# Altium schematic sheet soldeerboutmainbody1.SchDoc
size A4; SheetNumber: 1; SheetTotal: 3
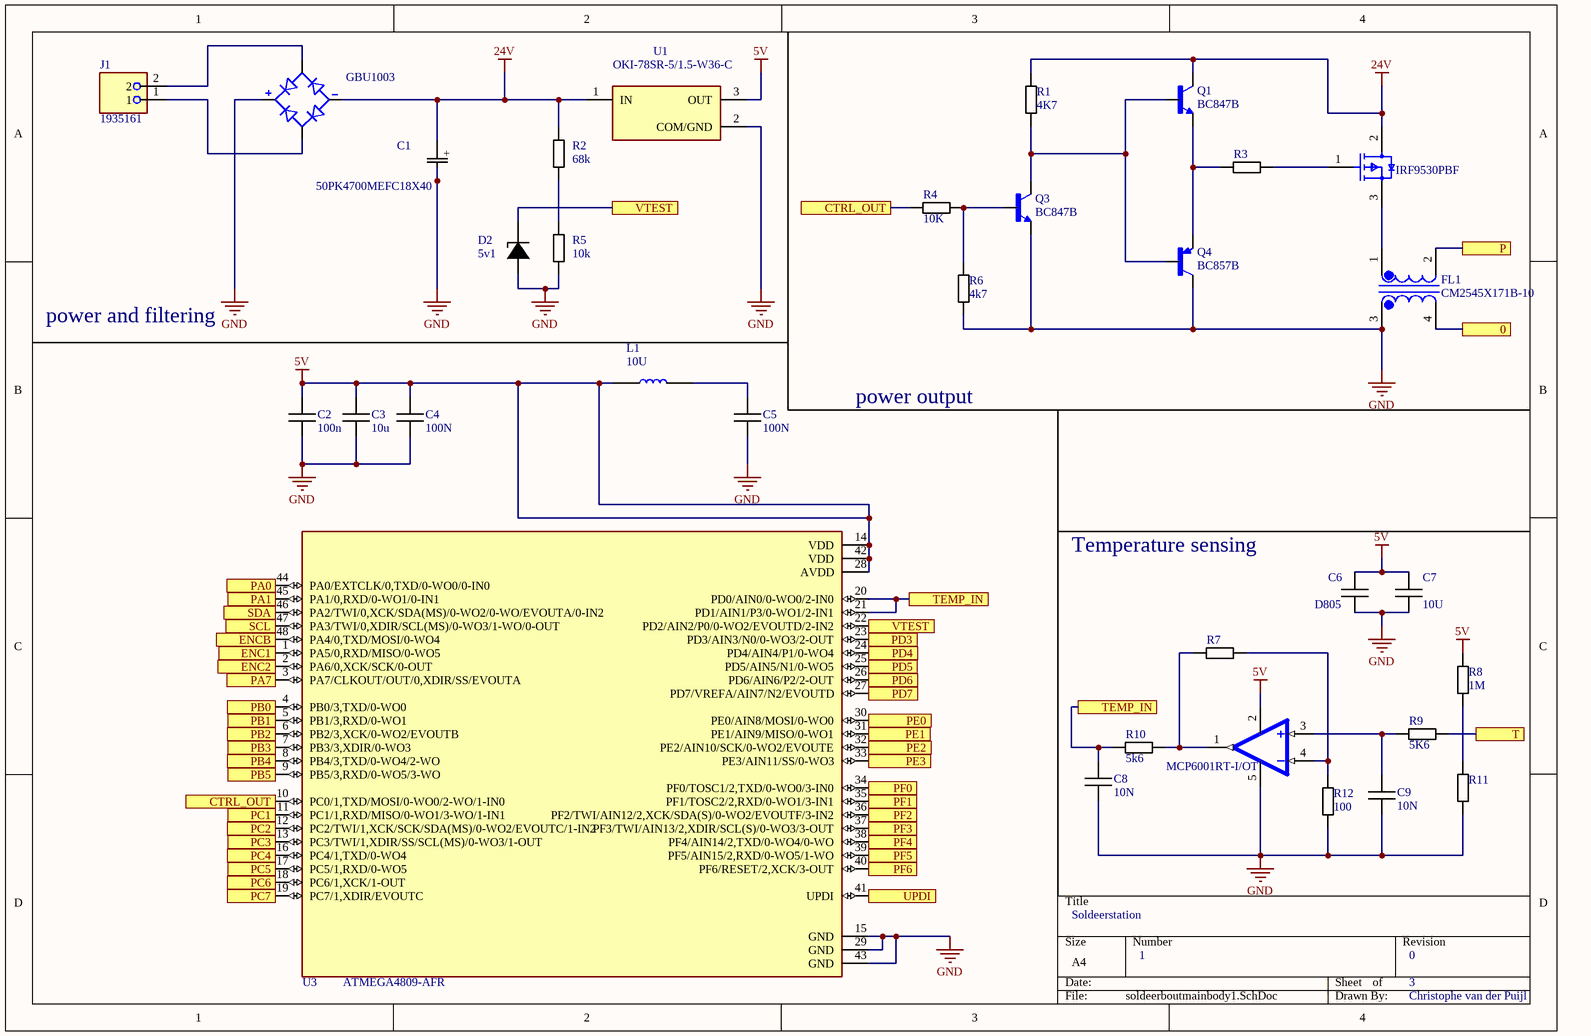
[diagram p0: soldeerboutmainbody1.SchDoc]

## Parts
C1  50PK4700MEFC18X40  [CAP_PKPZ_18X40_RUB]
C2  100n  [C 0603 / 1608]
C3  10u  [C 0603 / 1608]
C4  100N  [C 0603 / 1608]
C5  100N  [C 0603 / 1608]
C6  D805  [C 0603 / 1608]
C7  10U  [C 0603 / 1608]
C8  10N  [C 0603 / 1608]
C9  10N  [C 0603 / 1608]
D1  GBU1003  [SIP343W114P508L2205H2134Q4]
D2  5v1  [SOD3715X135N]
FL1  CM2545X171B-10  [XFMR_CM2545X171B-10]
J1  1935161  [PHOENIX_1935161]
L1  10U  [INDC2012X145N]
Q1  BC847B  [TRANS_BC847B]
Q2  IRF9530PBF  [FP-X15-0364-MFG]
Q3  BC847B  [TRANS_BC847B]
Q4  BC857B  [SOT95P240X120-3N]
R1  4K7  [R 0603]
R2  68k  [R 0603]
R3  100  [R 0603]  (value not drawn)
R4  10K  [R 0603]
R5  10k  [R 0603]
R6  4k7  [R 0603]
R7  18k  [R 0603]  (value not drawn)
R8  1M  [R 0603]
R9  5K6  [R 0603]
R10  5k6  [R 0603]
R11  10M  [R 0603]  (value not drawn)
R12  100  [R 0603]
U1  OKI-78SR-5/1.5-W36-C  [CONV_OKI-78SR-5/1.5-W36-C]
U2  MCP6001RT-I/OT  [SOT95P280X145-5N]
U3  ATMEGA4809-AFR  [QFP50P900X900X120-48N]

## Ports
0 (see soldeerboutmainbody2[4A]), CTRL_OUT (see soldeerboutmainbody1[1D]), CTRL_OUT (see soldeerboutmainbody1[3A]), ENC1 (see soldeerboutmainbody2[2A]), ENC2 (see soldeerboutmainbody2[2A]), ENCB (see soldeerboutmainbody2[2A]), P (see soldeerboutmainbody2[4A]), PA0 (see soldeerboutmainbody2[1D]), PA1 (see soldeerboutmainbody2[1D]), PA7 (see soldeerboutmainbody2[1D]), PB0 (see soldeerboutmainbody2[1D]), PB1 (see soldeerboutmainbody2[1D]), PB2 (see soldeerboutmainbody2[1D]), PB3 (see soldeerboutmainbody2[1D]), PB4 (see soldeerboutmainbody2[1D]), PB5 (see soldeerboutmainbody2[1D]), PC1 (see soldeerboutmainbody2[1D]), PC2 (see soldeerboutmainbody2[1D]), PC3 (see soldeerboutmainbody2[1D]), PC4 (see soldeerboutmainbody2[1D]), PC5 (see soldeerboutmainbody2[1D]), PC6 (see soldeerboutmainbody2[1D]), PC7 (see soldeerboutmainbody2[1D]), PD3 (see soldeerboutmainbody2[1C]), PD4 (see soldeerboutmainbody2[1C]), PD5 (see soldeerboutmainbody2[1C]), PD6 (see soldeerboutmainbody2[1C]), PD7 (see soldeerboutmainbody2[1C]), PE0 (see soldeerboutmainbody2[1C]), PE1 (see soldeerboutmainbody2[1C]), PE2 (see soldeerboutmainbody2[1C]), PE3 (see soldeerboutmainbody2[1C]), PF0 (see soldeerboutmainbody2[1C]), PF1 (see soldeerboutmainbody2[1C]), PF2 (see soldeerboutmainbody2[1D]), PF3 (see soldeerboutmainbody2[1D]), PF4 (see soldeerboutmainbody2[3A]), PF5 (see soldeerboutmainbody2[3B]), PF6 (see soldeerboutmainbody2[3A]), SCL (see soldeerboutmainbody2[1A], soldeerboutmainbody2[2A]), SDA (see soldeerboutmainbody2[1A], soldeerboutmainbody2[2A]), T (see soldeerboutmainbody2[4A]), TEMP_IN (see soldeerboutmainbody1[3C]), UPDI (see soldeerboutmainbody2[3B]), VTEST (see soldeerboutmainbody1[2A]), VTEST (see soldeerboutmainbody1[3C])

## Nets
5V: C2.1 C3.1 C4.1 C6.1 C7.1 L1.1 R8.2 U1.3(OUT) U2.2(VSS) U3.14(VDD) U3.28(AVDD) U3.42(VDD)
24V: C1.1 D1.NEG Q1.3(C) Q2.2(D) R1.2 R2.2 U1.1(IN)
GND: C1.2 C2.2 C3.2 C4.2 C5.2 C6.2 C7.2 C8.2 C9.2 D1.POS D2.A FL1.3 Q3.2(E) Q4.3(C) R5.1 R6.1 R11.1 R12.1 U1.2(COM/GND) U2.5(VDD) U3.15(GND) U3.29(GND) U3.43(GND)
0: FL1.4 ; port 0
CTRL_OUT: R4.1 U3.10(PC0/1,TXD/MOSI/0-WO0/2-WO/1-IN0) ; port CTRL_OUT
ENC1: U3.1(PA5/0,RXD/MISO/0-WO5) ; port ENC1
ENC2: U3.2(PA6/0,XCK/SCK/0-OUT) ; port ENC2
ENCB: U3.48(PA4/0,TXD/MOSI/0-WO4) ; port ENCB
P: FL1.2 ; port P
PA0: U3.44(PA0/EXTCLK/0,TXD/0-WO0/0-IN0) ; port PA0
PA1: U3.45(PA1/0,RXD/0-WO1/0-IN1) ; port PA1
PA7: U3.3(PA7/CLKOUT/OUT/0,XDIR/SS/EVOUTA) ; port PA7
PB0: U3.4(PB0/3,TXD/0-WO0) ; port PB0
PB1: U3.5(PB1/3,RXD/0-WO1) ; port PB1
PB2: U3.6(PB2/3,XCK/0-WO2/EVOUTB) ; port PB2
PB3: U3.7(PB3/3,XDIR/0-WO3) ; port PB3
PB4: U3.8(PB4/3,TXD/0-WO4/2-WO) ; port PB4
PB5: U3.9(PB5/3,RXD/0-WO5/3-WO) ; port PB5
PC1: U3.11(PC1/1,RXD/MISO/0-WO1/3-WO/1-IN1) ; port PC1
PC2: U3.12(PC2/TWI/1,XCK/SCK/SDA(MS)/0-WO2/EVOUTC/1-IN2) ; port PC2
PC3: U3.13(PC3/TWI/1,XDIR/SS/SCL(MS)/0-WO3/1-OUT) ; port PC3
PC4: U3.16(PC4/1,TXD/0-WO4) ; port PC4
PC5: U3.17(PC5/1,RXD/0-WO5) ; port PC5
PC6: U3.18(PC6/1,XCK/1-OUT) ; port PC6
PC7: U3.19(PC7/1,XDIR/EVOUTC) ; port PC7
PD3: U3.23(PD3/AIN3/N0/0-WO3/2-OUT) ; port PD3
PD4: U3.24(PD4/AIN4/P1/0-WO4) ; port PD4
PD5: U3.25(PD5/AIN5/N1/0-WO5) ; port PD5
PD6: U3.26(PD6/AIN6/P2/2-OUT) ; port PD6
PD7: U3.27(PD7/VREFA/AIN7/N2/EVOUTD) ; port PD7
PE0: U3.30(PE0/AIN8/MOSI/0-WO0) ; port PE0
PE1: U3.31(PE1/AIN9/MISO/0-WO1) ; port PE1
PE2: U3.32(PE2/AIN10/SCK/0-WO2/EVOUTE) ; port PE2
PE3: U3.33(PE3/AIN11/SS/0-WO3) ; port PE3
PF0: U3.34(PF0/TOSC1/2,TXD/0-WO0/3-IN0) ; port PF0
PF1: U3.35(PF1/TOSC2/2,RXD/0-WO1/3-IN1) ; port PF1
PF2: U3.36(PF2/TWI/AIN12/2,XCK/SDA(S)/0-WO2/EVOUTF/3-IN2) ; port PF2
PF3: U3.37(PF3/TWI/AIN13/2,XDIR/SCL(S)/0-WO3/3-OUT) ; port PF3
PF4: U3.38(PF4/AIN14/2,TXD/0-WO4/0-WO) ; port PF4
PF5: U3.39(PF5/AIN15/2,RXD/0-WO5/1-WO) ; port PF5
PF6: U3.40(PF6/RESET/2,XCK/3-OUT) ; port PF6
SCL: U3.47(PA3/TWI/0,XDIR/SCL(MS)/0-WO3/1-WO/0-OUT) ; port SCL
SDA: U3.46(PA2/TWI/0,XCK/SDA(MS)/0-WO2/0-WO/EVOUTA/0-IN2) ; port SDA
T: R9.2 ; port T
TEMP_IN: C8.1 R10.1 U3.20(PD0/AIN0/0-WO0/2-IN0) U3.21(PD1/AIN1/P3/0-WO1/2-IN1) ; port TEMP_IN
UPDI: U3.41(UPDI) ; port UPDI
VTEST: D2.K U3.22(PD2/AIN2/P0/0-WO2/EVOUTD/2-IN2) ; port VTEST
NetC5_1: C5.1 L1.2
NetC9_1: C9.1 R9.1 U2.3(VIN+)
NetD1_AC1: D1.AC1 J1.2
NetD1_AC2: D1.AC2 J1.1
NetFL1_1: FL1.1 Q2.3(S)
NetQ1_1: Q1.1(B) Q3.3(C) Q4.1(B) R1.1
NetQ1_2: Q1.2(E) Q4.2(E) R3.1
NetQ2_1: Q2.1(G) R3.2
NetQ3_1: Q3.1(B) R4.2 R6.2
NetR2_1: R2.1 R5.2
NetR7_1: R7.1 R10.2 U2.1(VOUT)
NetR7_2: R7.2 R12.2 U2.4(VIN-)
NetR8_1: R8.1 R11.2

## Notes on the sheet
- power and filtering
- power output
- Temperature sensing
- Soldeerstation
- 1
- 3
- 0
- Christophe van der Puijl
- (in symbol 50PK4700MEFC18X40) +

## Library data of the parts
C1 = 50PK4700MEFC18X40: No Description Available; Mfr_Name: Rubycon
C2-C9 = Capacitor
D1 = GBU1003: MF: {'manufacturer': u'Taiwan Semiconductor'}; Package: None; Price: None; Value: *; MP: GBU1003; Availability: Unavailable
D2 = MMSZ5231B-7-F: MF: {'manufacturer': u'Diodes Inc.'}; Package: None; Price: None; Value: *; MP: MMSZ5231B-7-F; Availability: Unavailable
FL1 = CM2545X171B-10: MF: {'manufacturer': u'Laird'}; Package: None; Price: None; Value: *; MP: CM2545X171B-10; Availability: Unavailable
J1 = 1935161: MF: {'manufacturer': u'Phoenix Contact'}; Package: None; Price: None; Value: *; MP: 1935161; Availability: Unavailable
L1 = MLZ2012N100LT000: Inductor Power Shielded Multi-Layer 10uH 20% 2MHz Ferrite 500mA 390mOhm DCR 0805 T/R; MF: {'manufacturer': u'TDK'}; Package: None; Price: None; Value: *; MP: MLZ2012N100LT000; Availability: Unavailable
Q1 Q3 = BC847B: <a href="https://pricing.snapeda.com/parts/BC847B/Diotec%20Semiconductor/view-part?ref=eda">Check availability</a>; MF: {'manufacturer': u'STMicroelectronics'}; Package: None; Price: None; Value: *; MP: BC847B; Availability: Unavailable
Q2 = CMP-02550-000233-1: MOSFET P-CH 100V 12A TO-220AB; Drain to Source Breakdown Voltage: -100V; On-State Resistance: 300mR; Gate to Source Voltage (Vgs): 20V; Recovery Time: 240ns; Power Dissipation: 88W; Threshold Voltage: -4V; Number of Channels: 1; Current Rating: -12A; Fall Time: 39ns; Polarity: P-CHANNEL; Turn-On Delay Time: 12ns; Element Configuration: Single; Input Capacitance: 860pF; Rise Time: 52ns; Turn-Off Delay Time: 31ns; Polarization: P; Lead Free: Lead Free; RoHS Compliant: Yes; Radiation Hardening: No; Width: 4.7mm; Drain to Source Resistance: 300mR; Package Quantity: 50; Height: 9.01mm; Length: 10.41mm; Rds On Max: 300mR; Min Operating Temperature: -55°C; Case/Package: TO-220AB; Continuous Drain Current (ID): 12A; Number of Pins: 3; Weight: 0.211644oz; Max Operating Temperature: 175°C; Series: -; Max Power Dissipation: 88W; Voltage Rating (DC): -100V; Mount: Through Hole; Packaging: Rail/Tube; Number of Elements: 1; Drain-source On Resistance-Max: 300mR; Drain to Source Voltage (Vdss): 100V
Q4 = BC857B: MF: {'manufacturer': u'Diotec'}; Package: None; Price: None; Value: *; MP: BC857B; Availability: Unavailable
R1-R12 = Resistor
U1 = OKI-78SR-5/1.5-W36-C: OKI Series 8 W Single Output 5 V Non Isolated Through Hole DC/DC Converter; MF: {'manufacturer': u'Murata Power Solutions'}; Package: None; Price: None; Value: *; MP: OKI-78SR-5/1.5-W36-C; Availability: Unavailable
U2 = MCP6001RT-I/OT: General Purpose Amplifier 1 Circuit Rail-to-Rail SOT-23-5; MF: {'manufacturer': u'Microchip Technology'}; Package: None; Price: None; Value: *; MP: MCP6001RT-I/OT; Availability: Unavailable
U3 = ATMEGA4809-AFR: 20MHz 48KB TQFP48 Ind 125C Green T&R; MF: {'manufacturer': u'Microchip'}; Package: None; Price: None; Value: *; MP: ATMEGA4809-AFR; Availability: Unavailable